# EAGLE design Basic Interface (EAGLE 7.1.0)
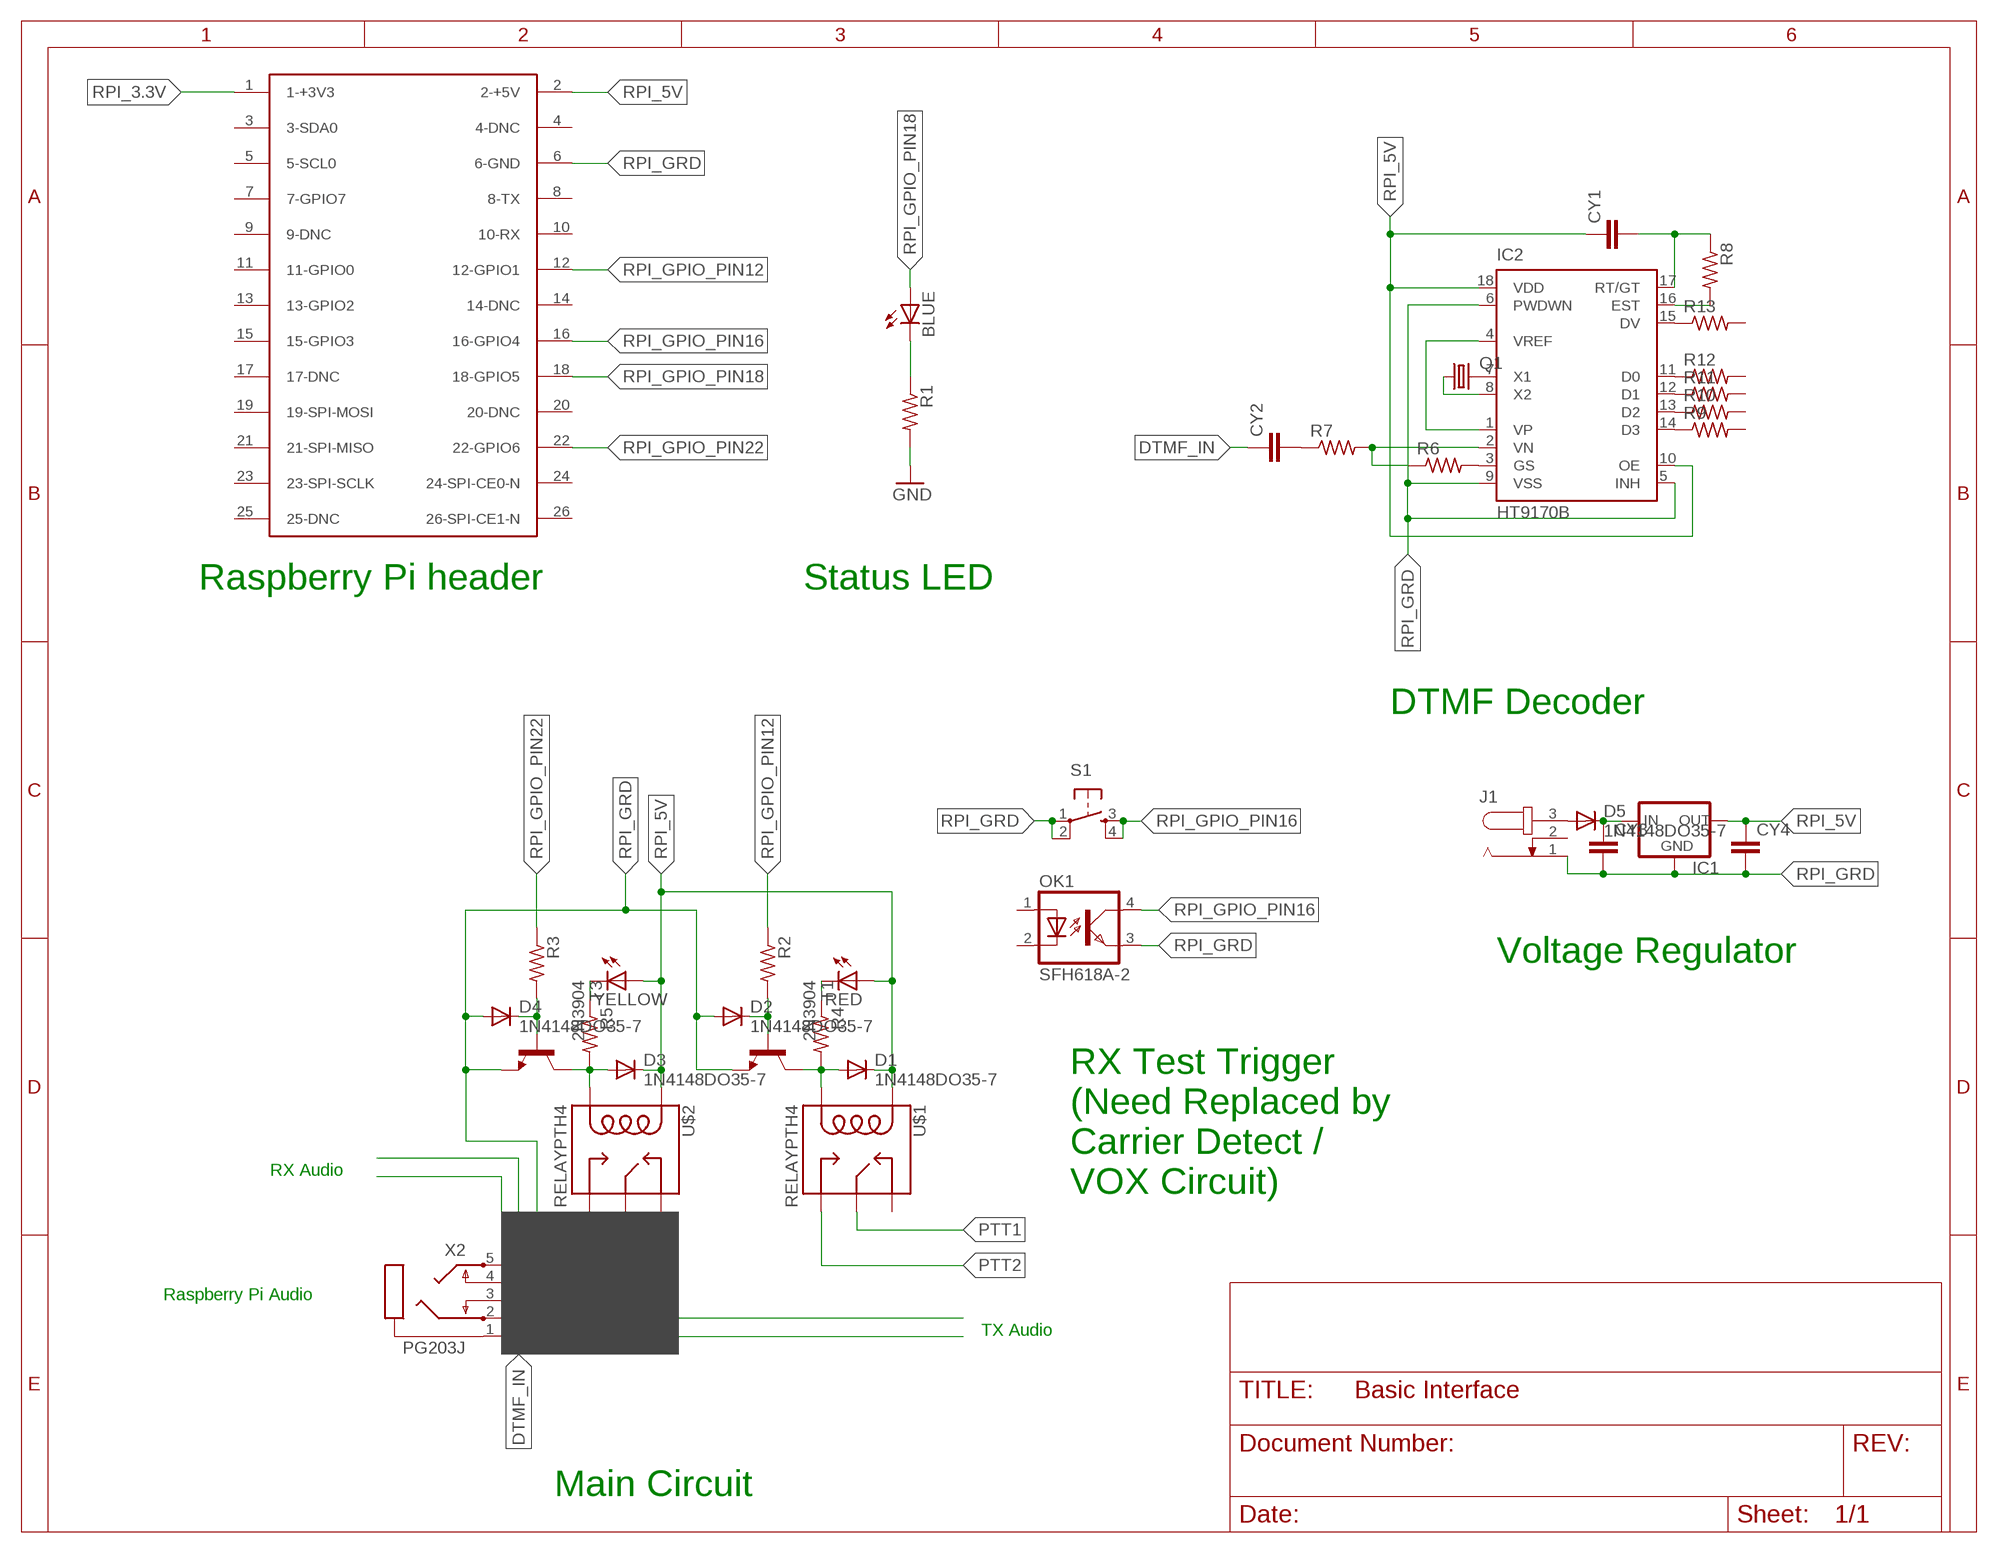
[diagram p0: schematic, sheet 1]

## Parts
BLUE  LED3MM  [LED3MM]
CY1  CYYC7B5  [YC7B5]
CY2  CYYC7B5  [YC7B5]
CY3  CYYC7B5  [YC7B5]
CY4  CYYC7B5  [YC7B5]
D1  1N4148DO35-7  [DO35-7]
D2  1N4148DO35-7  [DO35-7]
D3  1N4148DO35-7  [DO35-7]
D4  1N4148DO35-7  [DO35-7]
D5  1N4148DO35-7  [DO35-7]
IC1  V_REG_78XX-TO-220  [TO-220-ALT]
IC2  HT9170B  [DIL18]
J1  JACK-PLUG0  [SPC4077]
OK1  SFH618A-2  [DIP4]
Q1  CRYSTALHC49U-V  [HC49U-V]
R1  R-US_0204/7  [0204/7]
R2  R-US_0204/7  [0204/7]
R3  R-US_0204/7  [0204/7]
R4  R-US_0204/7  [0204/7]
R5  R-US_0204/7  [0204/7]
R6  R-US_0204/7  [0204/7]
R7  R-US_0204/7  [0204/7]
R8  R-US_0204/7  [0204/7]
R9  R-US_0204/7  [0204/7]
R10  R-US_0204/7  [0204/7]
R11  R-US_0204/7  [0204/7]
R12  R-US_0204/7  [0204/7]
R13  R-US_0204/7  [0204/7]
RED  LED3MM  [LED3MM]
S1  TAC_SWITCHPTH  [TACTILE-PTH]
T1  2N3904  [TO92]
T3  2N3904  [TO92]
U$1  RELAYPTH4  [RELAY-JZC]
U$2  RELAYPTH4  [RELAY-JZC]
X1  P1A  RASPBERRY-PIHEADER  [RASPBERRY-PI-HEADER]
X2  PG203J  [PG203J]
YELLOW  LED3MM  [LED3MM]

## Nets
DTMF_IN: CY2.1 U$2.4(MAIN)
GND: R1.2
N$1: BLUE.K(C) R1.1
N$2: R4.1 RED.K(C)
N$3: U$2.2(NC) X2.5
N$4: D2.C R2.2 T1.2(B)
N$5: D1.A R4.2 T1.1(C) U$1.1(COIL2)
N$6: R5.1 YELLOW.K(C)
N$7: IC2.7(X1) Q1.2
N$8: D4.C R3.2 T3.2(B)
N$9: D3.A R5.2 T3.1(C) U$2.1(COIL2)
N$10: IC2.8(X2) Q1.1
N$11: IC2.14(D3) R9.1
N$12: IC2.2(VN) R6.1 R7.2
N$13: IC2.13(D2) R10.1
N$15: IC2.3(GS) R6.2
N$16: IC2.1(VP) IC2.4(VREF)
N$17: IC2.12(D1) R11.1
N$18: IC2.11(D0) R12.1
N$19: IC2.15(DV) R13.1
N$22: CY3.1 D5.C IC1.IN
N$23: IC2.16(EST) R8.2
N$24: CY1.2 IC2.17(RT/GT) R8.1
N$25: CY2.2 R7.1
N$26: D5.A J1.3
PTT1: U$1.4(MAIN)
PTT2: U$1.3(NO)
RPI_3.3V: X1.1(1-+3V3)
RPI_5V: CY1.1 CY4.1 D1.C D3.C IC1.OUT IC2.10(OE) IC2.18(VDD) RED.A U$1.5(COIL1) U$2.5(COIL1) X1.2(2-+5V) YELLOW.A
RPI_GPIO_PIN12: R2.1 X1.12(12-GPIO1)
RPI_GPIO_PIN16: OK1.4(COL) S1.3 S1.4 X1.16(16-GPIO4)
RPI_GPIO_PIN18: BLUE.A X1.18(18-GPIO5)
RPI_GPIO_PIN22: R3.1 X1.22(22-GPIO6)
RPI_GRD: CY3.2 CY4.2 D2.A D4.A IC1.GND IC2.5(INH) IC2.6(PWDWN) IC2.9(VSS) J1.1 OK1.3(EMIT) S1.1 S1.2 T1.3(E) T3.3(E) X1.6(6-GND) X2.1
Unconnected: J1.2 OK1.1(A) OK1.2(C) R9.2 R10.2 R11.2 R12.2 R13.2 U$1.2(NC) U$2.3(NO) X1.3(3-SDA0) X1.4(4-DNC) X1.5(5-SCL0) X1.7(7-GPIO7) X1.8(8-TX) X1.9(9-DNC) X1.10(10-RX) X1.11(11-GPIO0) X1.13(13-GPIO2) X1.14(14-DNC) X1.15(15-GPIO3) X1.17(17-DNC) X1.19(19-SPI-MOSI) X1.20(20-DNC) X1.21(21-SPI-MISO) X1.23(23-SPI-SCLK) X1.24(24-SPI-CE0-N) X1.25(25-DNC) X1.26(26-SPI-CE1-N) X2.2 X2.3 X2.4

## Notes on the sheet
- Raspberry Pi header | Status LED
- DTMF Decoder
- Voltage Regulator
- RX Audio
- RX Test Trigger
  (Need Replaced by
  Carrier Detect /
  VOX Circuit)
- Raspberry Pi Audio
- TX Audio
- Main Circuit

## Library data of the parts
BLUE RED YELLOW = led:LED: LED OSRAM: - CHIPLED LG R971, LG N971, LY N971, LG Q971, LY Q971, LO R971, LY R971 LH N974, LH R974 LS Q976, LO Q976, LY Q976 LO Q996 - Hyper CHIPLED LW Q18S LB Q993, LB Q99A, LB R99A - SideLED LS A670, LO A670, LY A670, LG A670, LP A670 LB A673, LV A673, LT A673, LW A673 LH A674 LY A675 LS A676, LA A676, LO A676, LY A676, LW A676 LS A679, LY A679, LG A679 - Hyper Micro SIDELED® LS Y876, LA Y876, LO Y876, LY Y876 LT Y87S - SmartLED LW L88C, LW L88S LB L89C, LB L89S, LG L890 LS L89K, LO L89K, LY L89K LS L896, LA L896, LO L896, LY L896 - TOPLED LS T670, LO T670, LY T670, LG T670, LP T670 LSG T670, LSP T670, LSY T670, LOP T670, LYG T670 LG T671, LOG T671, LSG T671 LB T673, LV T673, LT T673, LW T673 LH T674 LS T676, LA T676, LO T676, LY T676, LB T676, LH T676, LSB T676, LW T676 LB T67C, LV T67C, LT T67C, LS T67K, LO T67K, LY T67K, LW E67C LS E67B, LA E67B, LO E67B, LY E67B, LB E67C, LV E67C, LT E67C LW T67C LS T679, LY T679, LG T679 LS T770, LO T770, LY T770, LG T770, LP T770 LB T773, LV T773, LT T773, LW T773 LH T774 LS E675, LA E675, LY E675, LS T675 LS T776, LA T776, LO T776, LY T776, LB T776 LHGB T686 LT T68C, LB T68C - Hyper Mini TOPLED® LB M676 - Mini TOPLED Santana® LG M470 LS M47K, LO M47K, LY M47K Source: http://www.osram.convergy.de LUXEON: - LUMILED® LXK2-PW12-R00, LXK2-PW12-S00, LXK2-PW14-U00, LXK2-PW14-V00 LXK2-PM12-R00, LXK2-PM12-S00, LXK2-PM14-U00 LXK2-PE12-Q00, LXK2-PE12-R00, LXK2-PE12-S00, LXK2-PE14-T00, LXK2-PE14-U00 LXK2-PB12-K00, LXK2-PB12-L00, LXK2-PB12-M00, LXK2-PB14-N00, LXK2-PB14-P00, LXK2-PB14-Q00 LXK2-PR12-L00, LXK2-PR12-M00, LXK2-PR14-Q00, LXK2-PR14-R00 LXK2-PD12-Q00, LXK2-PD12-R00, LXK2-PD12-S00 LXK2-PH12-R00, LXK2-PH12-S00 LXK2-PL12-P00, LXK2-PL12-Q00, LXK2-PL12-R00 Source: www.luxeon.com KINGBRIGHT: KA-3528ASYC Source: www.kingbright.com
CY1-CY4 = rcl:CY: Y CAPACITOR for power line
D1-D5 = diode:1N4148: DIODE high speed (Philips)
IC1 = SparkFun-PowerIC:V_REG_78XX: Voltage Regulator Standard 7805 5V regulator. IGO (Input Ground Output). Spark Fun Electronics SKU : COM-00107
IC2 = holtek:HT9170: DTMF Receiver Source: http://www.holtek.com/pdf/comm/9170v111.pdf; OC_FARNELL: unknown; OC_NEWARK: unknown
J1 = con-jack:JACK-PLUG: DC POWER JACK Power Jack, DC, Right Angle, Through Hole, Rated 5A at 16VDC, PC Terminals Distributor: Farnell (www.Farnell.de) Drawing: 84N1161.pdf / 84N1162.pdf Manufacturer: SPC Technology (www.spctechnology.com) Type: SPC4077 / SPC 4078; OC_FARNELL: unknown; OC_NEWARK: unknown
OK1 = optocoupler:SFH618?*: Optocoupler, Phototransistor Output, Low Input Current Source: Data sheet <http://www.vishay.com/docs/83673/sfh618.pdf>; MF: VISHAY/TELEFUNKEN; MPN: SFH618A-2; OC_FARNELL: 6424855; OC_NEWARK: 21H7744
Q1 = crystal:CRYSTAL: CRYSTAL; OC_FARNELL: 1666969; OC_NEWARK: unknown
R1-R13 = resistor:R-US_: RESISTOR, American symbol
S1 = SparkFun-Electromechanical:TAC_SWITCH: Momentary Switch Button commonly used for reset or general input. Spark Fun Electronics SKU : COM-00097 SMT- SWCH-08247
T1 T3 = transistor:2N3904: NPN TRANSISTOR
U$1 U$2 = SparkFun-Electromechanical:RELAY: SPDT relay (COM-00101)
X1 = SteveMarple:RASPBERRY-PI: Raspberry Pi Board <http://www.raspberrypi.org/> Jacques Lagnel V1.0 (beta) 2012 Board dimension: Forum 3D model <http://www.raspberrypi.org/forum/general-discussion/mechanical-profile-3d-models?value=3d%20model&type=1&include=1&search=1&ret=all> The GPIO Connector (P1): http://elinux.org/RPi_Low-level_peripherals
X2 = con-hirschmann:PG203J: MIC/HEADPHONE JACK KS-S stereo microphone/headphone jack PG203JN (Schukat); OC_FARNELL: unknown; OC_NEWARK: unknown

## Net classes
1 power: width 0.381 mm
2 5V: width 0.381 mm
3 antenna: width 0.61 mm

## Board
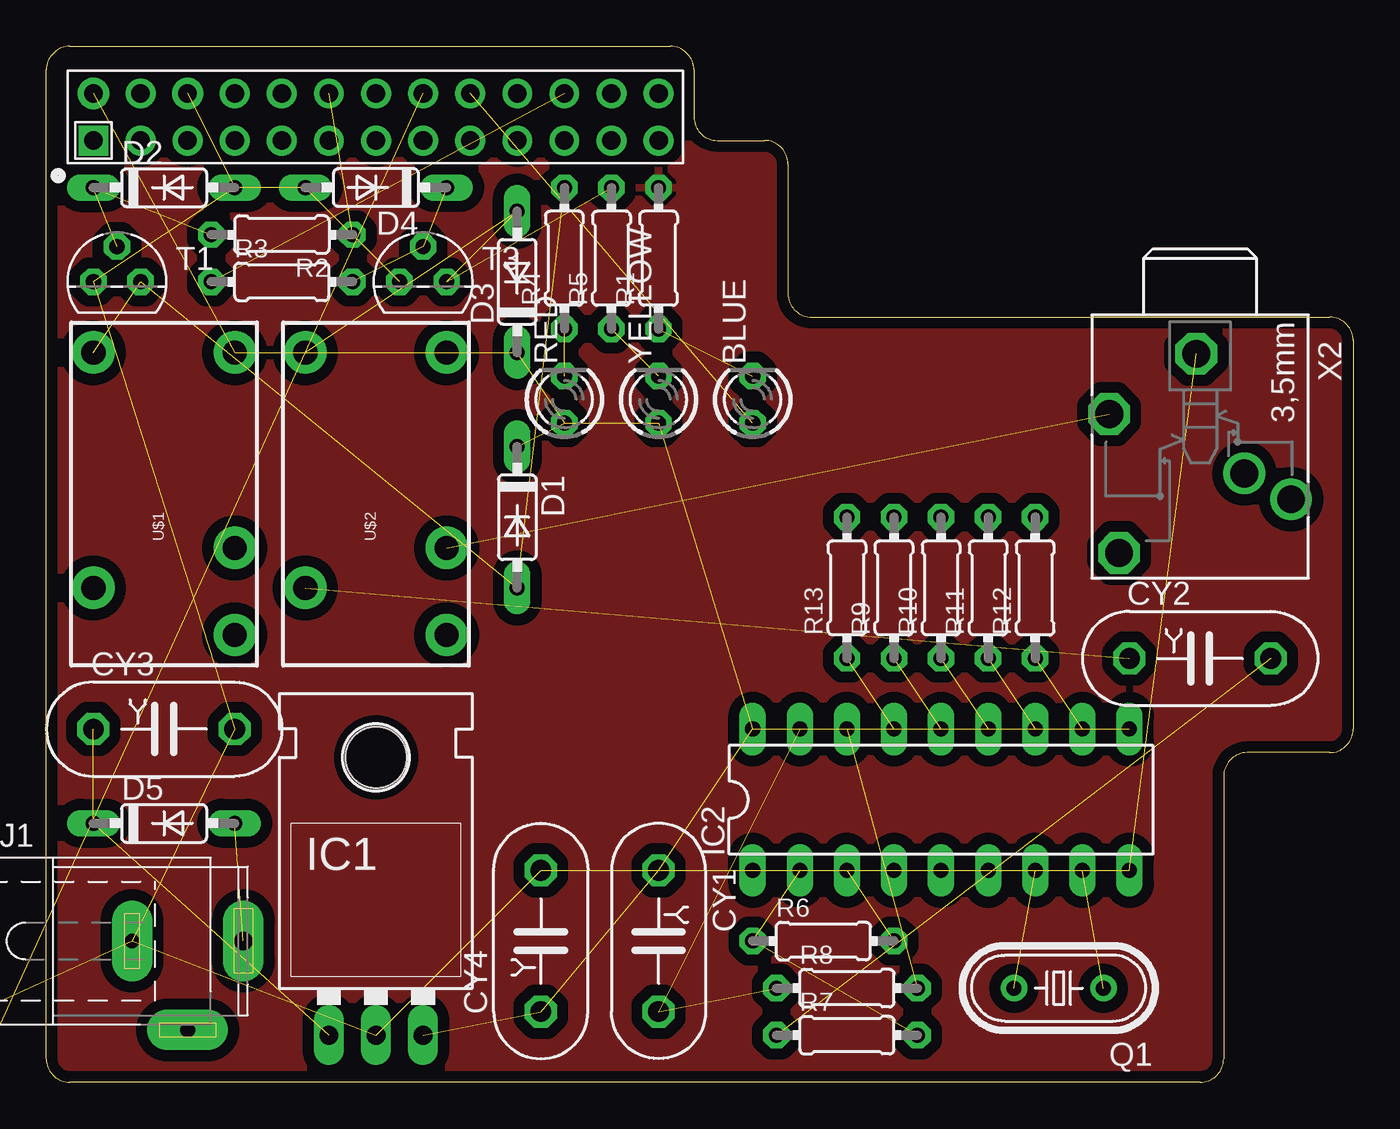
[diagram p1: board, top side]
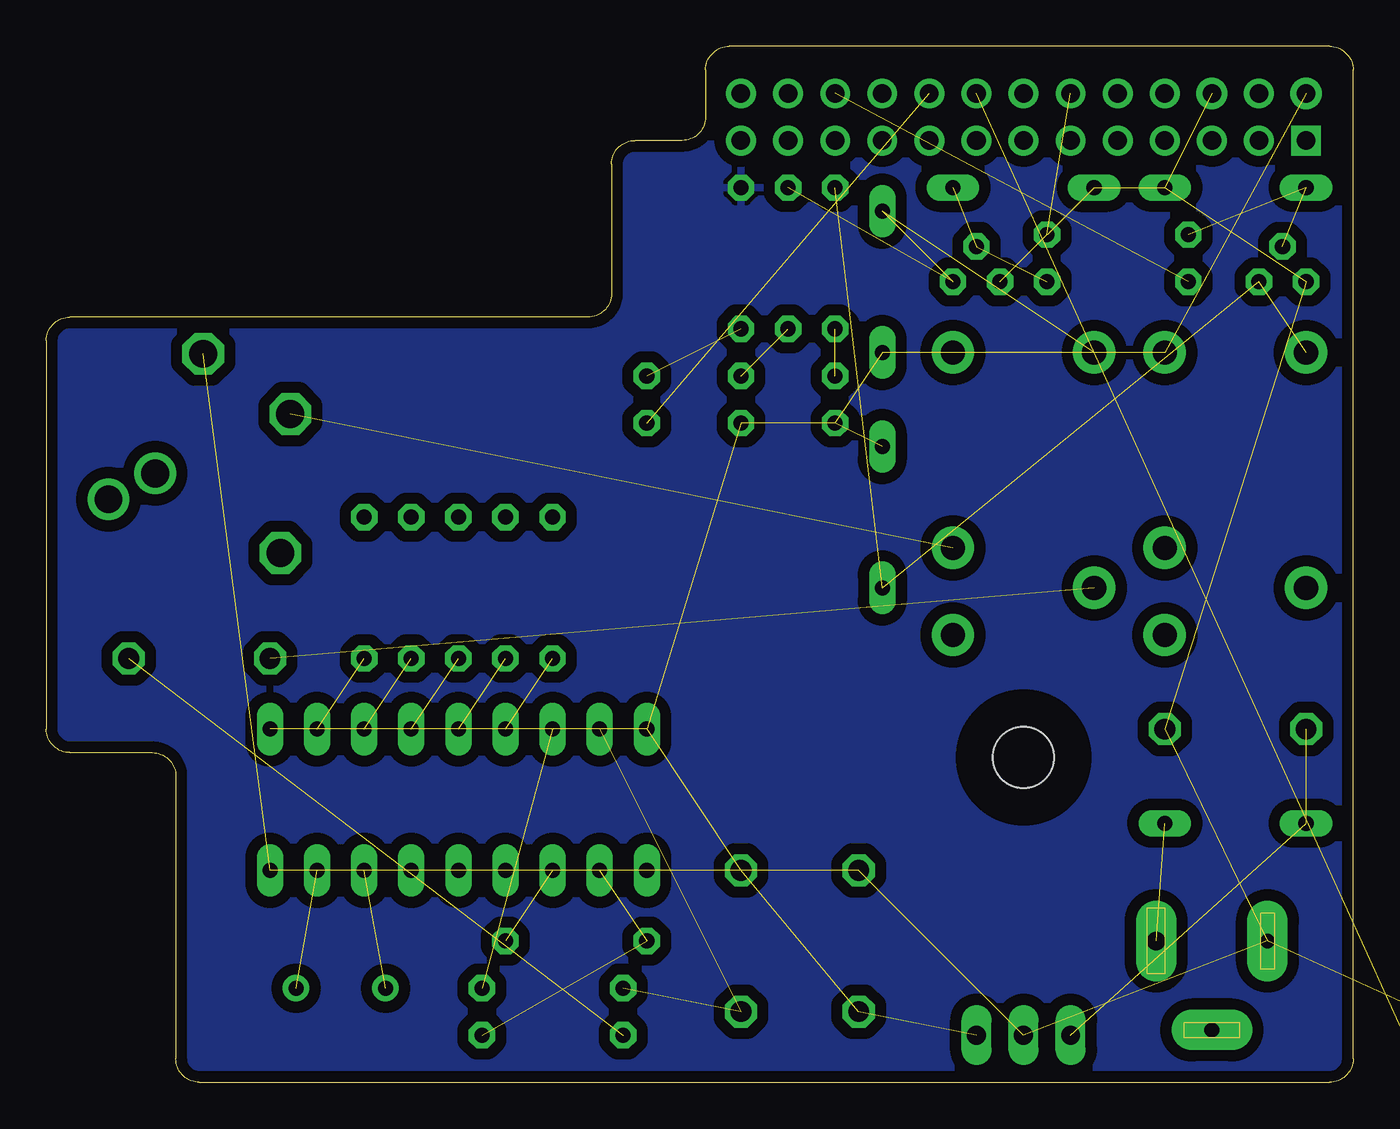
[diagram p2: board, bottom side, seen from below]

Size 70.48 x 55.88 mm. Coordinates in mm from the lower left corner, seen from the top.
Outline: 0,1.27 0,54.61 arc-90 1.27,55.88 33.66,55.88 arc-90 34.92,54.61 34.92,52.07 arc90 36.2,50.8 38.73,50.8 arc-90 40.01,49.53 40.01,42.55 arc90 41.27,41.27 69.22,41.27 arc-90 70.48,40.01 70.48,19.05 arc-90 69.22,17.78 64.77,17.78 arc90 63.5,16.51 63.5,1.27 arc-90 62.23,0 1.27,0 arc-90 0,1.27
Copper layers (1*16): Top 0.035mm / dielectric 1.5mm / Bottom 0.035mm
Design rules "SparkFun_Iteadstudio_very_conservative": minimum track width 12mil, minimum drill 20mil, track to track 12mil, track to pad 12mil, pad to pad 12mil, via to via 12mil, smd to smd 12mil, copper to edge 0.5mm, drill to drill 8mil, minimum pad ring 12mil, minimum via ring 12mil, stop-mask expansion 4mil, vias tented up to drill 25mil, thermal gap 10mil

### Footprints (pad centres in the part's own frame; a part is rotated, then mirrored left to right if it is on the bottom)
LED3MM = drill 0.813 octagon: A -1.27,0; K 1.27,0
YC7B5 = drill 1.118 octagon: 1 -3.81,0; 2 3.81,0
DO35-7 = drill 0.813 long: A 3.81,0; C -3.81,0
TO-220-ALT = drill 1.016 long: GND 0,-3.81; IN -2.54,-3.81; OUT 2.54,-3.81 | hole 3.302: 0,11.176
DIL18 = drill 0.813 long: 1 -10.16,-3.81; 2 -7.62,-3.81; 3 -5.08,-3.81; 4 -2.54,-3.81; 5 0,-3.81; 6 2.54,-3.81; 7 5.08,-3.81; 8 7.62,-3.81; 9 10.16,-3.81; 10 10.16,3.81; 11 7.62,3.81; 12 5.08,3.81; 13 2.54,3.81; 14 0,3.81; 15 -2.54,3.81; 16 -5.08,3.81; 17 -7.62,3.81; 18 -10.16,3.81
SPC4077 = drill 0.8 pad 2.184 long: 1 -3,0; 2 0,-4.8 | drill 1 pad 2.184 long: 3 3,0
DIP4 = drill 0.8: 1 -1.27,-3.81; 2 1.27,-3.81; 3 1.27,3.81; 4 -1.27,3.81
HC49U-V = drill 0.813: 1 -2.413,0; 2 2.413,0
0204/7 = drill 0.813 octagon: 1 -3.81,0; 2 3.81,0
TACTILE-PTH = drill 1.016 pad 1.88: 1 -3.251,2.261; 2 3.251,2.261; 3 -3.251,-2.261; 4 3.251,-2.261
TO92 = drill 0.813 octagon: 1 1.27,0; 2 0,1.905; 3 -1.27,0
RELAY-JZC = drill 1.3 pad 2.286: 1 3.81,-8.89; 2 -3.81,1.651; 3 -3.81,6.35; 4 3.81,3.81; 5 -3.81,-8.89
RASPBERRY-PI-HEADER = drill 1 square: 1 0,0 | drill 1 pad 1.676: 2 0,2.54; 6 5.08,2.54 | drill 1: 3 2.54,0; 4 2.54,2.54; 5 5.08,0; 7 7.62,0; 8 7.62,2.54; 9 10.16,0; 10 10.16,2.54; 11 12.7,0; 12 12.7,2.54; 13 15.24,0; 14 15.24,2.54; 15 17.78,0; 16 17.78,2.54; 17 20.32,0; 18 20.32,2.54; 19 22.86,0; 20 22.86,2.54; 21 25.4,0; 22 25.4,2.54; 23 27.94,0; 24 27.94,2.54; 25 30.48,0; 26 30.48,2.54
PG203J = drill 1.499 octagon: 1 -5.004,-0.203; 4 5.74,-4.369; 5 -1.753,-4.902 | drill 1.499: 2 2.845,4.902; 3 1.448,2.388

### Placement (x,y rotation side)
BLUE  38.1,36.83 90 top
CY1  33.02,7.62 270 top
CY2  62.23,22.86 0 top
CY3  6.35,19.05 0 top
CY4  26.67,7.62 90 top
D1  25.4,30.48 270 top
D2  6.35,48.26 0 top
D3  25.4,43.18 90 top
D4  17.78,48.26 180 top
D5  6.35,13.97 0 top
IC1  17.78,6.35 0 top
IC2  48.26,15.24 0 top
J1  7.62,7.62 0 top
OK1  -16.51,-6.35 0 top  (outside the outline)
Q1  54.61,5.08 180 top
R1  33.02,44.45 90 top
R2  12.7,45.72 180 top
R3  12.7,43.18 0 top
R4  27.94,44.45 90 top
R5  30.48,44.45 90 top
R6  41.91,7.62 0 top
R7  43.18,2.54 0 top
R8  43.18,5.08 0 top
R9  45.72,26.67 90 top
R10  48.26,26.67 90 top
R11  50.8,26.67 90 top
R12  53.34,26.67 90 top
R13  43.18,26.67 90 top
RED  27.94,36.83 90 top
S1  -7.62,1.27 0 top  (outside the outline)
T1  3.81,43.18 0 top
T3  20.32,43.18 0 top
U$1  6.35,30.48 180 top
U$2  17.78,30.48 180 top
X1  2.54,50.8 0 top
X2  62.23,34.29 270 top
YELLOW  33.02,36.83 90 top

### Tracks (layer width: path | path; a pad name or v marks a point on that pad's centre or on a via)
DTMF_IN  (1 unrouted)
GND
  pour Bottom (isolate 0.61): -1.27,-1.27 -1.27,57.15 72.39,57.15 72.39,-1.27
  pour Top (isolate 0.61): -2.54,-2.54 -2.54,58.42 73.66,58.42 73.66,-2.54
N$1  (1 unrouted)
N$2  (1 unrouted)
N$3  (1 unrouted)
N$4  (2 unrouted)
N$5  (3 unrouted)
N$6  (1 unrouted)
N$7  (1 unrouted)
N$8  (2 unrouted)
N$9  (3 unrouted)
N$10  (1 unrouted)
N$11  (1 unrouted)
N$12  (2 unrouted)
N$13  (1 unrouted)
N$15  (1 unrouted)
N$16  (1 unrouted)
N$17  (1 unrouted)
N$18  (1 unrouted)
N$19  (1 unrouted)
N$22  (2 unrouted)
N$23  (1 unrouted)
N$24  (2 unrouted)
N$25  (1 unrouted)
N$26  (1 unrouted)
RPI_5V  (11 unrouted)
RPI_GPIO_PIN12  (1 unrouted)
RPI_GPIO_PIN16  (3 unrouted)
RPI_GPIO_PIN18  (1 unrouted)
RPI_GPIO_PIN22  (1 unrouted)
RPI_GRD  (15 unrouted)